# EasyEDA Pro project ProProject_P1_2024-06-12.epro, board PCB5
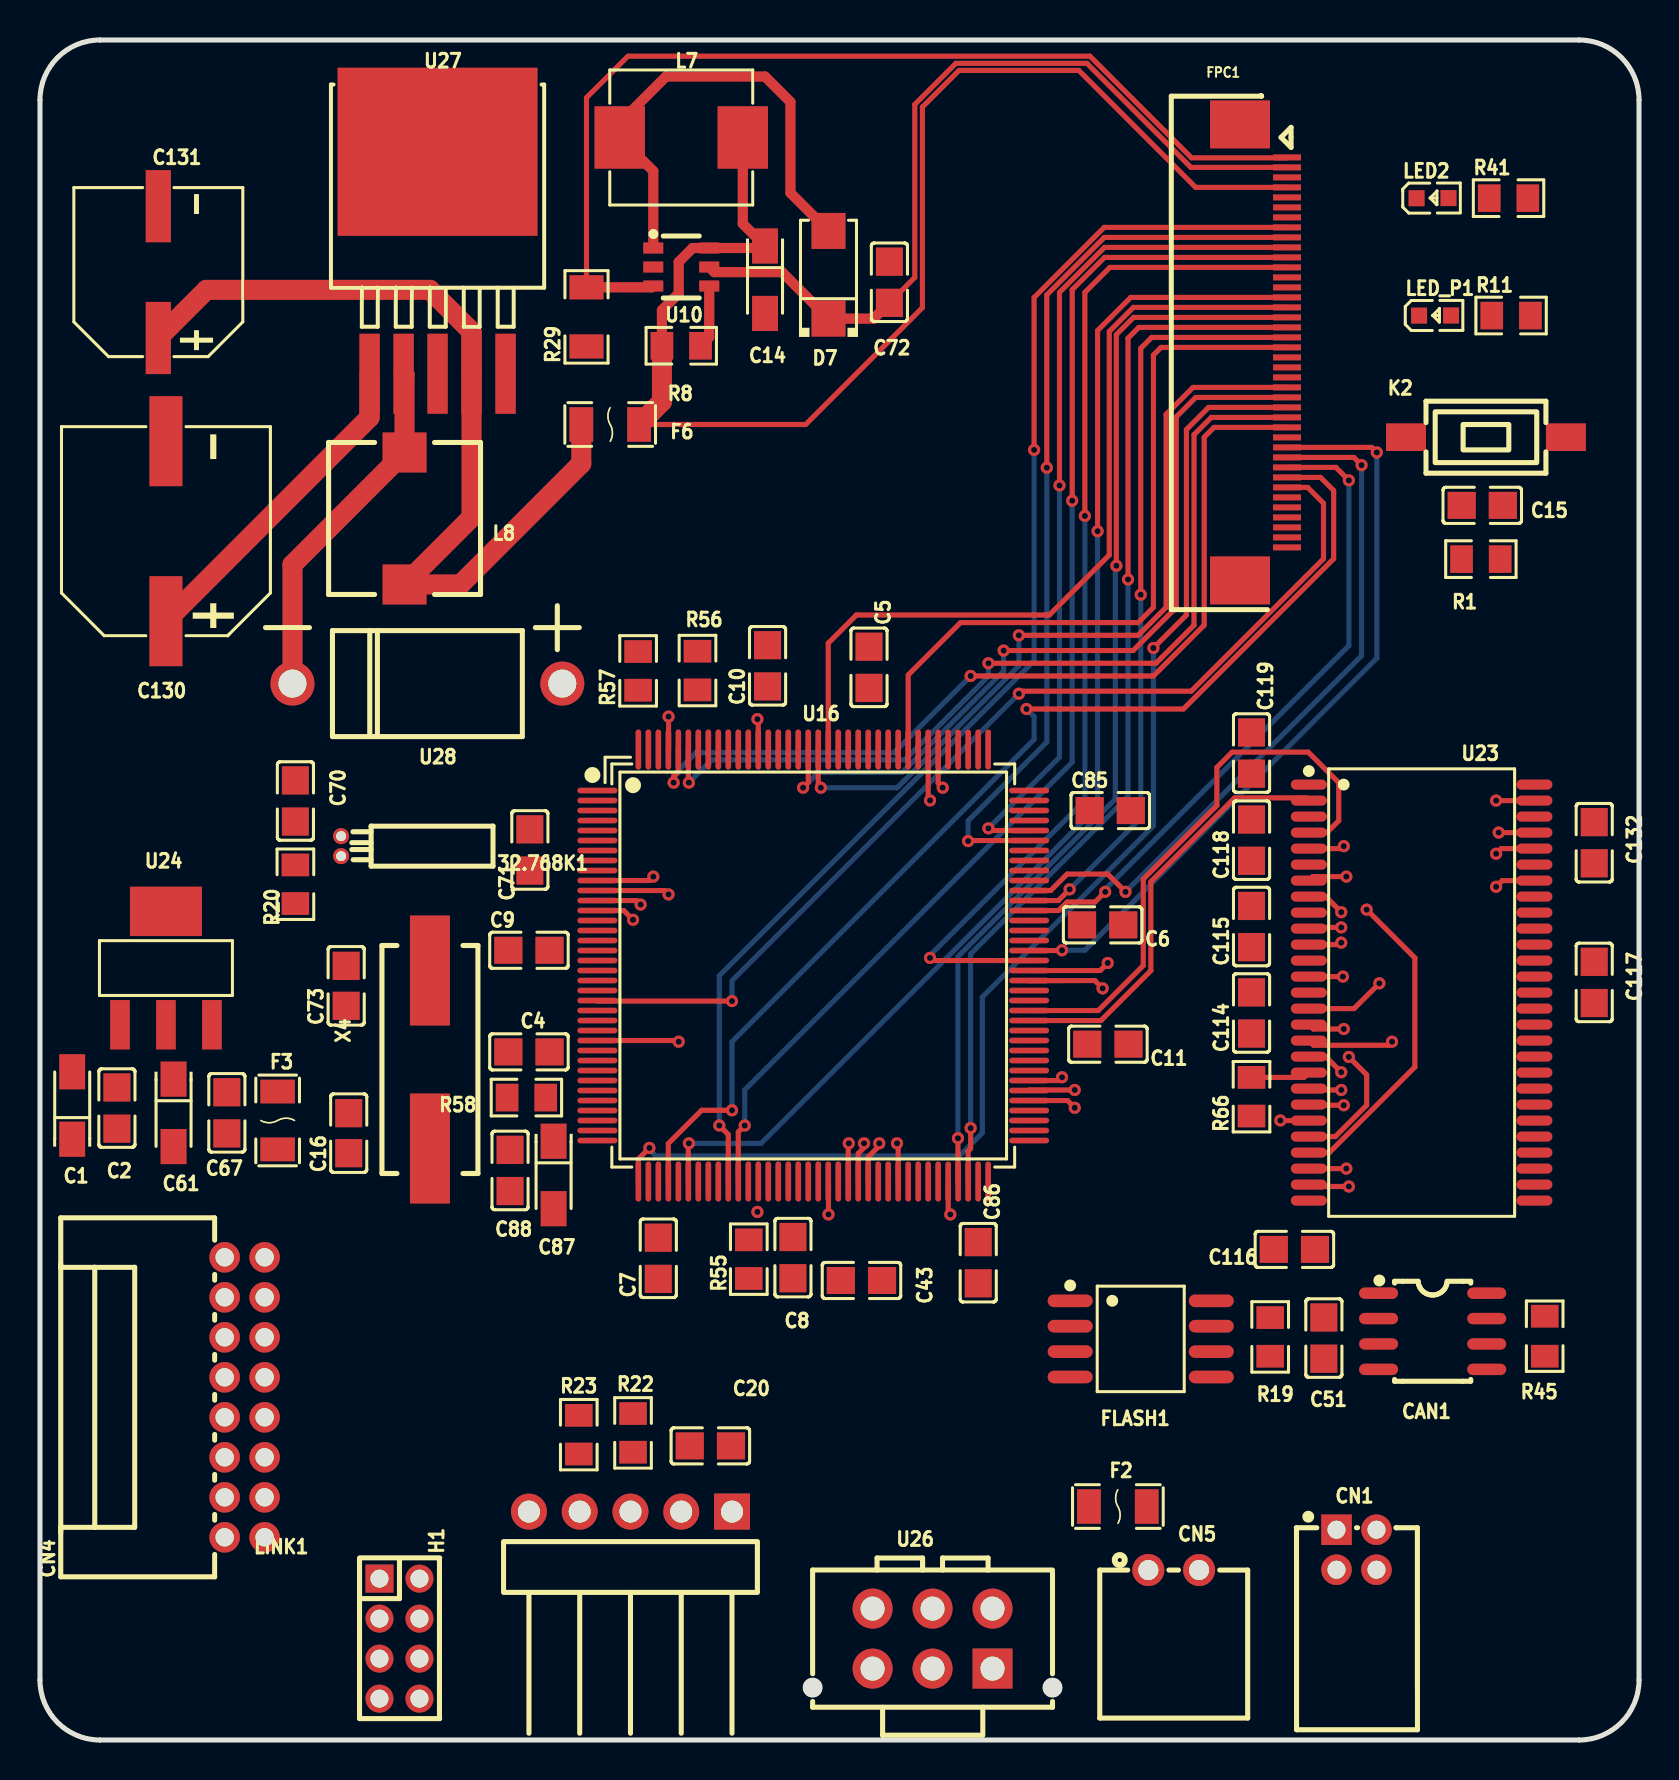
[diagram p1: board, top side]
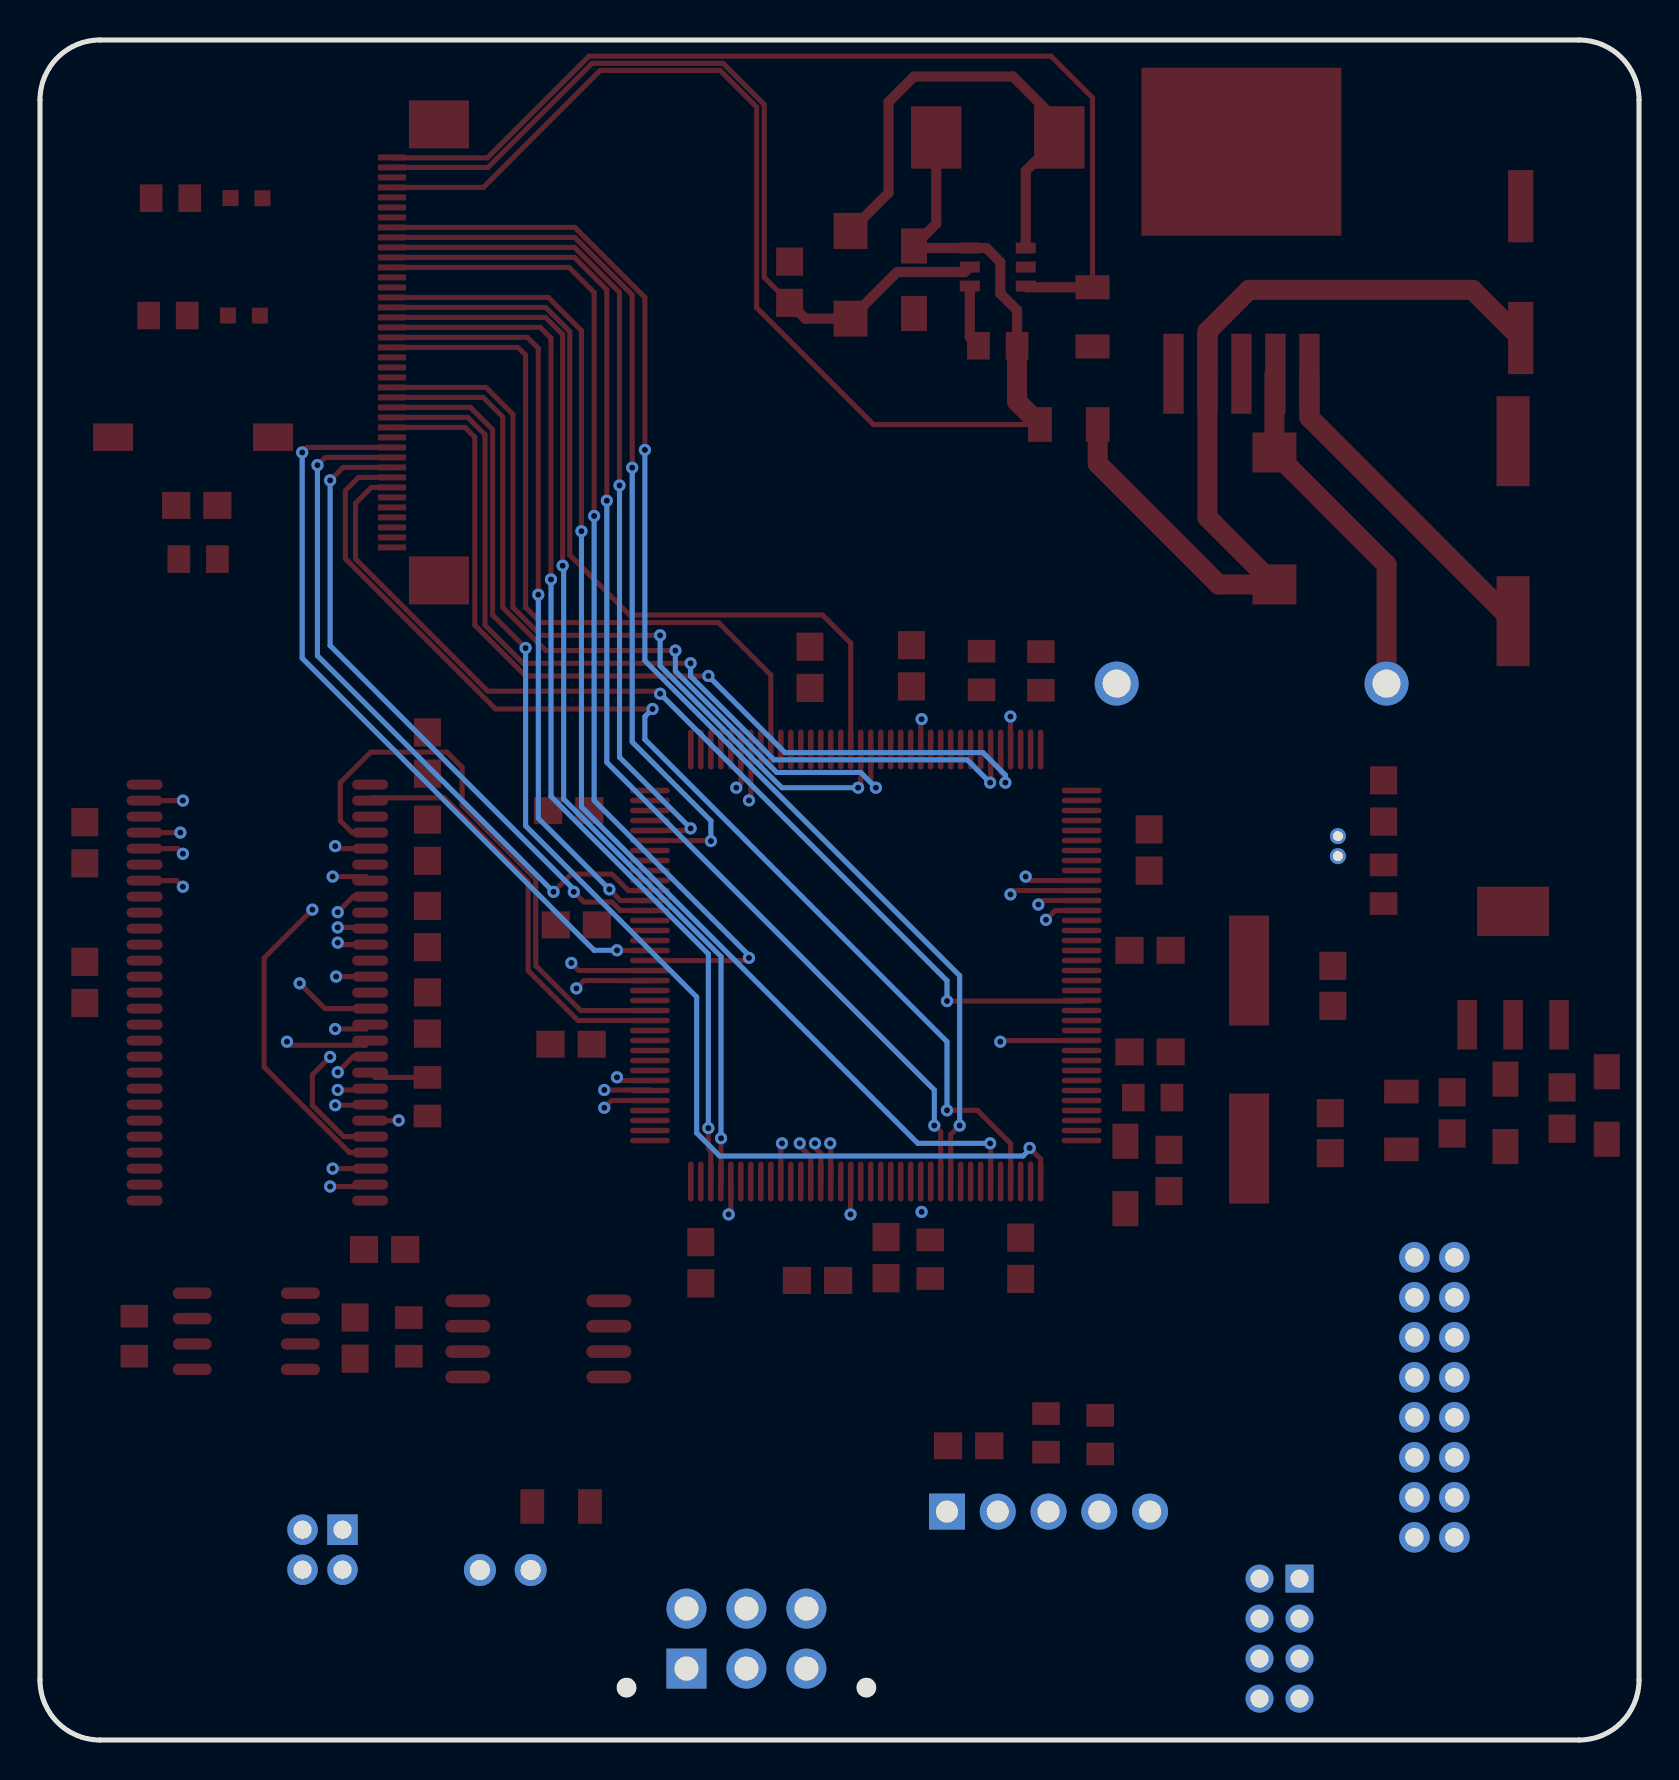
[diagram p2: board, bottom side, seen from below]

Outline 80 x 85 mm; copper layers: Top Layer, Inner1, Inner2, Bottom Layer. Coordinates in mm from the lower left corner of the outline.
Outline path: 0,82 0,3 arc(0.88,0.88) 3,0 77,0 arc(79.12,0.88) 80,3 80,82 arc(79.12,84.12) 77,85 3,85 arc(0.88,84.12) 0,82
Stack: Top Layer 0.035mm 外层铜厚1oz / Dielectric1 0.2104mm 7628 RC49% 8.6mil / Inner1 0.0152mm 内层铜厚 / Dielectric2 1.065mm 1.1mm H/HOZ 含铜 / Inner2 0.0152mm 内层铜厚 / Dielectric3 0.2104mm 7628 RC49% 8.6mil / Bottom Layer 0.035mm 外层铜厚1oz

## Design rules (mm)
template: JLCPCB Capability(Two Layers Board)
spacing copperThickness1oz (default): track to track 0.102, other pairs 0.152 to 0.3
spacing copperThickness2oz: track to track 0.203, other pairs 0.152 to 0.3
track width copperThickness1oz (default): min 0.127, default 0.254, max 2.54
track width copperThickness2oz: min 0.203, default 0.254, max 2.54
differential pair differentialPair (default): width min 0.127, default 0.254, max 2.54; gap min 0.152, default 0.152
via viaSize (default): diameter min 0.5, default 0.61, max 10; hole min 0.3, default 0.305, max 6.3

## Placement (name value [footprint] x y rotation side)
32.768K1  32.768kHz  [OSC-TH_BD2.0-P0.70-D0.3]  15.06 44.69 180 top
C1  10uF  [CAP-SMD_L3.2-W1.6-RD]  1.61 31.72 90 top
C2  100nF  [C0805]  3.85 31.6 270 top
C4  100nF  [C0805]  24.46 34.41 180 top
C5  100nF  [C0805]  41.48 53.63 270 top
C6  100nF  [C0805]  53.17 40.76 180 top
C7  100nF  [C0805]  30.94 24.09 90 top
C8  100nF  [C0805]  37.67 24.12 90 top
C9  100nF  [C0805]  24.46 39.49 0 top
C10  100nF  [C0805]  36.4 53.71 90 top
C11  100nF  [C0805]  53.43 34.79 180 top
C14  10uF  [CAP-SMD_L3.2-W1.6-RD]  36.27 73.01 270 top
C15  100nF  [C0805]  72.16 61.73 180 top
C16  22pF  [C0805#2]  15.45 30.34 90 top
C20  100nF  [C0805]  33.54 14.71 180 top
C43  100nF  [C0805]  41.1 22.98 0 top
C51  100nF  [C0805]  64.23 20.1 270 top
C61  10uF  [CAP-SMD_L3.2-W1.6-RD]  6.68 31.36 270 top
C67  100nF  [C0805]  9.35 31.36 90 top
C70  12pF  [C0805]  12.78 46.95 90 top
C71  12pF  [C0805]  24.51 44.5 90 top
C72  1uF  [C0805]  42.5 72.89 90 top
C73  22pF  [C0805#2]  15.32 37.71 90 top
C85  22uF  [C0805]  53.55 46.47 0 top
C86  22uF  [C0805]  46.94 23.86 270 top
C87  10uF  [CAP-SMD_L3.2-W1.6-RD]  25.7 28.25 270 top
C88  100nF  [C0805]  23.52 28.48 90 top
C114  100nF  [C0805]  60.61 36.35 90 top
C115  100nF  [C0805]  60.61 40.67 90 top
C116  100nF  [C0805]  62.76 24.53 180 top
C117  100nF  [C0805]  77.76 37.88 90 top
C118  100nF  [C0805]  60.61 44.99 90 top
C119  100nF  [C0805]  60.61 49.35 270 top
C130  680uF  [CAP-SMD_BD10.0-L10.3-W10.3-LS10.9-FD]  6.3 60.44 90 top
C131  220uF  [CAP-SMD_BD8.0-L8.3-W8.3-RD]  5.92 73.39 270 top
C132  100nF  [C0805]  77.76 44.86 270 top
CAN1  TJA1050T/CM,118  [SOIC-8_L5.0-W4.0-P1.27-LS6.0-BL]  69.67 20.44 270 top
CN1  M2026R-2x2P  [CONN-TH_M2026R-2X2P]  65.86 9.51 0 top
CN4  PHB-2*8AW  [CONN-TH_PHB-2-8AW]  10.24 17.13 90 top
CN5  XH-2AW  [CONN-TH_XH-2AW_C2908611]  56.72 8.5 0 top
D7  SS16  [SMA_L4.4-W2.6-LS5.0-RD]  39.45 73.26 90 top
F2  BSMD1206-200-12V  [F1206]  53.93 11.67 180 top
F3  BSMD1206-100-24V  [F1206]  11.89 30.98 270 top
F6  BSMD1206-100-24V  [F1206]  28.53 65.78 0 top
FLASH1  W25Q128JVSIQ  [SOIC-8_L5.3-W5.3-P1.27-LS8.0-BL]  55.07 20.06 270 top
FPC1  F0501-B-40-20T-R  [FPC-SMD_40P-P0.50_L4.4-W25.6]  61.21 69.38 270 top
H1  PZ200-2-04-Z  [HDR-TH_8P-P2.00-V-M-R2-C4-S2.00]  17.99 5.07 270 top
K2  RESET_KEY  [SW-SMD_L6.1-W3.6-LS8.0]  72.34 65.14 0 top
L7  22uH  [IND-SMD_L7.3-W6.6_MHCI06030]  32.08 80.13 0 top
L8  10uH  [IND-SMD_L7.6-W7.6]  18.24 61.08 90 top
LED2  NCD0603W1  [LED0603-RD]  69.67 77.09 0 top
LED_P1  NCD0603W1  [LED0603-RD]  69.8 71.22 0 top
LINK1  五线下载电路  [HDR-TH_5P-P2.54-H-M-W10.0-N]  29.54 11.42 180 top
R1  10kΩ  [R0805#2]  72.09 59.04 0 top
R8  10kΩ  [R0805#2]  32.08 69.71 0 top
R11  510  [R0805#2]  73.6 71.22 0 top
R19  22R  [R0805#2]  61.55 20.15 90 top
R20  1kΩ  [R0805#2]  12.78 42.79 270 top
R22  10kΩ  [R0805#2]  29.67 15.36 270 top
R23  10kΩ  [R0805#2]  26.96 15.27 270 top
R29  7.5Ω  [R1206]  27.34 71.16 90 top
R41  510  [R0805#2]  73.47 77.09 0 top
R45  120Ω  [R0805]  75.28 20.19 90 top
R55  10kΩ  [R0805#2]  35.46 24.04 90 top
R56  10kΩ  [R0805#2]  32.9 53.47 90 top
R57  0Ω  [R0805#2]  29.92 53.46 90 top
R58  0Ω  [R0805#2]  24.34 32.12 0 top
R66  10kΩ  [R0805#2]  60.61 32.16 90 top
U10  -  [SOT-23-6_L2.9-W1.6-P0.95-LS2.8-BR]  32.08 73.65 180 top
U16  STM32F429ZGT6  [LQFP-144_L20.0-W20.0-P0.50-LS22.0-BL]  38.69 38.72 270 top
U23  W9825G6KH-6  [TSOP-54_L22.2-W10.2-P0.80-LS11.8-BL]  69.12 37.37 270 top
U24  AMS1117-3.3  [SOT-223-4_L6.5-W3.5-P2.30-LS7.0-BR]  6.3 38.6 270 top
U26  ZX-MX3.0-2-3PZZ  [CONN-TH_6P-P3.00_HC-MX3.0-2X3A]  44.66 5.07 180 top
U27  LM2575S-3.3  [TO-263-5_L10.0-W8.4-P1.70-LS15.3-BR]  19.89 73.86 270 top
U28  1N5824  [DO-201AD_BD5.3-L9.5-P13.50-D1.4-RD]  19.38 52.82 0 top
X4  8MHz  [CRYSTAL-SMD_L11.5-W4.8-LS12.7]  19.51 34.03 270 top

## Footprints (pads in the part's own frame, mm; a bottom-side part is the same pattern mirrored in y, then rotated)
C0805
  rect 1.41x1.35 smd: 1(-1.03,0) 2(1.03,0)
C0805#2
  rect 1.41x1.35 smd: 1(-1,0) 2(1,0)
CAP-SMD_BD8.0-L8.3-W8.3-RD
  rect 3.61x1.26 smd: 1(3.295,0) 2(-3.295,0)
CAP-SMD_BD10.0-L10.3-W10.3-LS10.9-FD
  rect 4.5x1.65 smd: 1(-4.5,0) 2(4.5,0)
CAP-SMD_L3.2-W1.6-RD
  rect 1.758x1.296 smd: 1(-1.687,0) 2(1.687,0)
CONN-TH_6P-P3.00_HC-MX3.0-2X3A
  rect 2x2 hole 1.2: 1(-3,1.5)
  round 2 hole 1.2: 2(-3,-1.5) 3(0,1.5) 4(0,-1.5) 5(3,1.5) 6(3,-1.5)
CONN-TH_M2026R-2X2P
  rect 1.524x1.524 hole 0.9: 1(-1,1)
  round 1.524 hole 0.9: 2(1,1) 3(1,-1) 4(-1,-1)
CONN-TH_PHB-2-8AW
  round 1.524 hole 0.914: 1(-7,-0.999) 2(-7,1) 3(-5.001,-0.999) 4(-5.001,1) 5(-3,-1) 6(-3,1) 7(-1,-1) 8(-1,1) 9(1,-1) 10(1,1) 11(3,-1) 12(3,1) 13(5,-1) 14(5,1) 15(7,-1) 16(7,1)
CONN-TH_XH-2AW_C2908611
  round 1.6 hole 1: 1(-1.27,0) 2(1.27,0)
CRYSTAL-SMD_L11.5-W4.8-LS12.7
  rect 5.499x1.999 smd: 1(-4.45,0) 2(4.45,0)
DO-201AD_BD5.3-L9.5-P13.50-D1.4-RD
  round 2.2 hole 1.4: 1(-6.75,0) 2(6.75,0)
F1206
  rect 1.19x1.728 smd: 1(-1.445,0) 2(1.445,0)
FPC-SMD_40P-P0.50_L4.4-W25.6
  rect 2.4x3 smd: 0(-11.4,-1.175) 0(11.4,-1.175)
  rect 0.3x1.4 smd: 1(-9.75,1.175) 2(-9.25,1.175) 3(-8.75,1.175) 4(-8.25,1.175) 5(-7.75,1.175) 6(-7.25,1.175) 7(-6.75,1.175) 8(-6.25,1.175) 9(-5.75,1.175) 10(-5.25,1.175) 11(-4.75,1.175) 12(-4.25,1.175) 13(-3.75,1.175) 14(-3.25,1.175) 15(-2.75,1.175) 16(-2.25,1.175) 17(-1.75,1.175) 18(-1.25,1.175) 19(-0.75,1.175) 20(-0.25,1.175) 21(0.25,1.175) 22(0.75,1.175) 23(1.25,1.175) 24(1.75,1.175) 25(2.25,1.175) 26(2.75,1.175) 27(3.25,1.175) 28(3.75,1.175) 29(4.25,1.175) 30(4.75,1.175) 31(5.25,1.175) 32(5.75,1.175) 33(6.25,1.175) 34(6.75,1.175) 35(7.25,1.175) 36(7.75,1.175) 37(8.25,1.175) 38(8.75,1.175) 39(9.25,1.175) 40(9.75,1.175)
HDR-TH_5P-P2.54-H-M-W10.0-N
  rect 1.8x1.8 hole 1.1: 1(-5.08,0)
  round 1.8 hole 1.1: 2(-2.54,0) 3(0,0) 4(2.54,0) 5(5.08,0)
HDR-TH_8P-P2.00-V-M-R2-C4-S2.00
  rect 1.4x1.4 hole 0.9: 1(-3,-1)
  round 1.4 hole 0.9: 2(-3,1) 3(-1,-1) 4(-1,1) 5(1,-1) 6(1,1) 7(3,-1) 8(3,1)
IND-SMD_L7.3-W6.6_MHCI06030
  rect 2.524x3.12 smd: 1(-3.078,0) 2(3.078,0)
IND-SMD_L7.6-W7.6
  rect 2x2.2 smd: 1(-3.3,0) 2(3.3,0)
LED0603-RD
  rect 0.8x0.8 smd: 1(-0.799,-0.004) 2(0.799,0.004)
LQFP-144_L20.0-W20.0-P0.50-LS22.0-BL
  oval 0.28x2 smd: 1(-8.75,-10.8) 2(-8.25,-10.8) 3(-7.75,-10.8) 4(-7.25,-10.8) 5(-6.75,-10.8) 6(-6.25,-10.8) 7(-5.75,-10.8) 8(-5.25,-10.8) 9(-4.75,-10.8) 10(-4.25,-10.8) 11(-3.75,-10.8) 12(-3.25,-10.8) 13(-2.75,-10.8) 14(-2.25,-10.8) 15(-1.75,-10.8) 16(-1.25,-10.8) 17(-0.75,-10.8) 18(-0.25,-10.8) 19(0.25,-10.8) 20(0.75,-10.8) 21(1.25,-10.8) 22(1.75,-10.8) 23(2.25,-10.8) 24(2.75,-10.8) 25(3.25,-10.8) 26(3.75,-10.8) 27(4.25,-10.8) 28(4.75,-10.8) 29(5.25,-10.8) 30(5.75,-10.8) 31(6.25,-10.8) 32(6.75,-10.8) 33(7.25,-10.8) 34(7.75,-10.8) 35(8.25,-10.8) 36(8.75,-10.8) 73(8.75,10.8) 74(8.25,10.8) 75(7.75,10.8) 76(7.25,10.8) 77(6.75,10.8) 78(6.25,10.8) 79(5.75,10.8) 80(5.25,10.8) 81(4.75,10.8) 82(4.25,10.8) 83(3.75,10.8) 84(3.25,10.8) 85(2.75,10.8) 86(2.25,10.8) 87(1.75,10.8) 88(1.25,10.8) 89(0.75,10.8) 90(0.25,10.8) 91(-0.25,10.8) 92(-0.75,10.8) 93(-1.25,10.8) 94(-1.75,10.8) 95(-2.25,10.8) 96(-2.75,10.8) 97(-3.25,10.8) 98(-3.75,10.8) 99(-4.25,10.8) 100(-4.75,10.8) 101(-5.25,10.8) 102(-5.75,10.8) 103(-6.25,10.8) 104(-6.75,10.8) 105(-7.25,10.8) 106(-7.75,10.8) 107(-8.25,10.8) 108(-8.75,10.8)
  oval 2x0.28 smd: 37(10.8,-8.75) 38(10.8,-8.25) 39(10.8,-7.75) 40(10.8,-7.25) 41(10.8,-6.75) 42(10.8,-6.25) 43(10.8,-5.75) 44(10.8,-5.25) 45(10.8,-4.75) 46(10.8,-4.25) 47(10.8,-3.75) 48(10.8,-3.25) 49(10.8,-2.75) 50(10.8,-2.25) 51(10.8,-1.75) 52(10.8,-1.25) 53(10.8,-0.75) 54(10.8,-0.25) 55(10.8,0.25) 56(10.8,0.75) 57(10.8,1.25) 58(10.8,1.75) 59(10.8,2.25) 60(10.8,2.75) 61(10.8,3.25) 62(10.8,3.75) 63(10.8,4.25) 64(10.8,4.75) 65(10.8,5.25) 66(10.8,5.75) 67(10.8,6.25) 68(10.8,6.75) 69(10.8,7.25) 70(10.8,7.75) 71(10.8,8.25) 72(10.8,8.75) 109(-10.8,8.75) 110(-10.8,8.25) 111(-10.8,7.75) 112(-10.8,7.25) 113(-10.8,6.75) 114(-10.8,6.25) 115(-10.8,5.75) 116(-10.8,5.25) 117(-10.8,4.75) 118(-10.8,4.25) 119(-10.8,3.75) 120(-10.8,3.25) 121(-10.8,2.75) 122(-10.8,2.25) 123(-10.8,1.75) 124(-10.8,1.25) 125(-10.8,0.75) 126(-10.8,0.25) 127(-10.8,-0.25) 128(-10.8,-0.75) 129(-10.8,-1.25) 130(-10.8,-1.75) 131(-10.8,-2.25) 132(-10.8,-2.75) 133(-10.8,-3.25) 134(-10.8,-3.75) 135(-10.8,-4.25) 136(-10.8,-4.75) 137(-10.8,-5.25) 138(-10.8,-5.75) 139(-10.8,-6.25) 140(-10.8,-6.75) 141(-10.8,-7.25) 142(-10.8,-7.75) 143(-10.8,-8.25) 144(-10.8,-8.75)
OSC-TH_BD2.0-P0.70-D0.3
  round 0.8 hole 0.5: 1(0,0.5) 2(0,-0.5)
R0805
  rect 1.133x1.377 smd: 1(-1,0) 2(1,0)
R0805#2
  rect 1.133x1.377 smd: 1(-0.966,0) 2(0.966,0)
R1206
  rect 1.208x1.701 smd: 1(-1.479,0) 2(1.479,0)
SMA_L4.4-W2.6-LS5.0-RD
  rect 1.8x1.7 smd: 1(-2.192,0) 2(2.192,0)
SOIC-8_L5.0-W4.0-P1.27-LS6.0-BL
  oval 0.569x1.95 smd: 1(-1.905,-2.705) 2(-0.635,-2.705) 3(0.635,-2.705) 4(1.905,-2.705) 5(1.905,2.705) 6(0.635,2.705) 7(-0.635,2.705) 8(-1.905,2.705)
SOIC-8_L5.3-W5.3-P1.27-LS8.0-BL
  oval 0.63x2.25 smd: 1(-1.905,-3.53) 2(-0.635,-3.53) 3(0.635,-3.53) 4(1.905,-3.53) 5(1.905,3.53) 6(0.635,3.53) 7(-0.635,3.53) 8(-1.905,3.53)
SOT-23-6_L2.9-W1.6-P0.95-LS2.8-BR
  rect 1x0.55 smd: 1(1.4,-0.95) 2(1.4,0) 3(1.4,0.95) 4(-1.4,0.95) 5(-1.4,0) 6(-1.4,-0.95)
SOT-223-4_L6.5-W3.5-P2.30-LS7.0-BR
  rect 2.47x0.98 smd: 1(2.835,-2.3) 2(2.835,0) 3(2.835,2.3)
  rect 2.47x3.6 smd: 4(-2.835,0)
SW-SMD_L6.1-W3.6-LS8.0
  rect 1.999x1.379 smd: 1(-4,0) 2(4,0)
TO-263-5_L10.0-W8.4-P1.70-LS15.3-BR
  rect 4x1.02 smd: 1(5.55,-3.4) 2(5.55,-1.7) 3(5.55,0) 4(5.55,1.7) 5(5.55,3.4)
  rect 8.4x10 smd: 6(-5.55,0)
TSOP-54_L22.2-W10.2-P0.80-LS11.8-BL
  oval 0.5x1.8 smd: 1(-10.4,-5.642) 2(-9.6,-5.642) 3(-8.8,-5.642) 4(-8,-5.642) 5(-7.2,-5.642) 6(-6.4,-5.642) 7(-5.6,-5.642) 8(-4.8,-5.642) 9(-4,-5.642) 10(-3.2,-5.642) 11(-2.4,-5.642) 12(-1.6,-5.642) 13(-0.8,-5.642) 14(0,-5.642) 15(0.8,-5.642) 16(1.6,-5.642) 17(2.4,-5.642) 18(3.2,-5.642) 19(4,-5.642) 20(4.8,-5.642) 21(5.6,-5.642) 22(6.4,-5.642) 23(7.2,-5.642) 24(8,-5.642) 25(8.8,-5.642) 26(9.6,-5.642) 27(10.4,-5.642) 28(10.4,5.642) 29(9.6,5.642) 30(8.8,5.642) 31(8,5.642) 32(7.2,5.642) 33(6.4,5.642) 34(5.6,5.642) 35(4.8,5.642) 36(4,5.642) 37(3.2,5.642) 38(2.4,5.642) 39(1.6,5.642) 40(0.8,5.642) 41(0,5.642) 42(-0.8,5.642) 43(-1.6,5.642) 44(-2.4,5.642) 45(-3.2,5.642) 46(-4,5.642) 47(-4.8,5.642) 48(-5.6,5.642) 49(-6.4,5.642) 50(-7.2,5.642) 51(-8,5.642) 52(-8.8,5.642) 53(-9.6,5.642) 54(-10.4,5.642)

## Nets
+5V: C1.1 C2.2 C51.1 C130.1 CAN1.3 CN1.1 F2.2 U24.3 U26.5 U27.1
GND: C1.2 C2.1 C4.1 C5.1 C6.1 C7.1 C8.1 C9.1 C10.1 C11.1 C14.2 C15.1 C16.2 C20.2 C43.2 C51.2 C61.2 C67.1 C70.2 C71.2 C72.2 C73.2 C85.2 C86.2 C87.2 C88.1 C114.1 C115.1 C116.1 C117.1 C118.1 C119.1 C130.2 C131.2 C132.1 CAN1.2 CAN1.8 CN1.4 CN4.2 CN4.4 CN4.6 CN4.8 CN4.10 CN4.12 CN4.14 CN4.16 CN5.2 FLASH1.4 FPC1.0 FPC1.3 FPC1.5 FPC1.6 FPC1.7 FPC1.13 FPC1.14 FPC1.21 FPC1.22 FPC1.23 FPC1.29 FPC1.35 FPC1.36 FPC1.37 FPC1.38 FPC1.39 FPC1.40 K2.2 LINK1.2 R11.2 R29.1 R55.1 R56.2 U10.2 U16.16 U16.31 U16.38 U16.51 U16.61 U16.83 U16.94 U16.107 U16.120 U16.130 U23.6 U23.12 U23.28 U23.41 U23.46 U23.52 U23.54 U24.1 U26.6 U27.3 U27.5 U27.6 U28.2
VCC: C4.2 C5.2 C6.2 C7.2 C8.2 C9.2 C10.2 C11.2 C20.1 C43.1 C87.1 C88.2 C114.2 C115.2 C116.2 C117.2 C118.2 C119.2 C132.2 F3.2 FLASH1.3 FLASH1.7 FLASH1.8 LED2.2 LED_P1.2 LINK1.1 R1.2 R22.1 R23.1 R57.1 R58.1 R66.1 U16.17 U16.30 U16.39 U16.52 U16.62 U16.72 U16.84 U16.95 U16.108 U16.121 U16.131 U16.144 U23.1 U23.3 U23.9 U23.14 U23.27 U23.43 U23.49
VCC_LCD: C14.1 F6.2 FPC1.4 L7.2 R8.1 U10.6
VDDA: R58.2 U16.32 U16.33
CAN2_RX: CAN1.4 U16.73
CAN2_TX: CAN1.1 U16.74
CAN_H: CAN1.7 CN1.2 H1.4 R45.2
CAN_L: CAN1.6 CN1.3 H1.3 R45.1
FMC_A0: U16.10 U23.23
FMC_A1: U16.11 U23.24
FMC_A2: U16.12 U23.25
FMC_A3: U16.13 U23.26
FMC_A4: U16.14 U23.29
FMC_A5: U16.15 U23.30
FMC_A6: U16.50 U23.31
FMC_A7: U16.53 U23.32
FMC_A8: U16.54 U23.33
FMC_A9: U16.55 U23.34
FMC_A10: U16.56 U23.22
FMC_A11: U16.57 U23.35
FMC_A12: U16.87 U23.36
FMC_BA0: U16.89 U23.20
FMC_BA1: U16.90 U23.21
FMC_D0: U16.85 U23.2
FMC_D1: U16.86 U23.4
FMC_D2: U16.114 U23.5
FMC_D3: U16.115 U23.7
FMC_D4: U16.58 U23.8
FMC_D5: U16.59 U23.10
FMC_D6: U16.60 U23.11
FMC_D7: U16.63 U23.13
FMC_D8: U16.64 U23.42
FMC_D9: U16.65 U23.44
FMC_D10: U16.66 U23.45
FMC_D11: U16.67 U23.47
FMC_D12: U16.68 U23.48
FMC_D13: U16.77 U23.50
FMC_D14: U16.78 U23.51
FMC_D15: U16.79 U23.53
FMC_NBL0: U16.141 U23.15
FMC_NBL1: U16.142 U23.39
FMC_SDCAS: U16.132 U23.17
FMC_SDCKE0: U16.29 U23.37
FMC_SDCLK: U16.93 U23.38
FMC_SDNE0: R66.2 U16.28 U23.19
FMC_SDNWE: U16.26 U23.16
FMC_SDRAS: U16.49 U23.18
INPUT1: CN4.1 U16.20
INPUT2: CN4.3 U16.19
INPUT3: CN4.5 U16.18
INPUT4: CN4.7 U16.5
INPUT5: CN4.9 U16.4
INPUT6: CN4.11 U16.3
INPUT7: CN4.13 U16.2
INPUT8: CN4.15 U16.1
LED1: R41.2 U16.136
LEDA: C72.1 D7.1 FPC1.2 U10.5
LEDK: FPC1.1 R29.2 U10.3
LTDC-B5: FPC1.26 U16.37
LTDC_B3: FPC1.24 U16.126
LTDC_B4: FPC1.25 U16.127
LTDC_B6: FPC1.27 U16.139
LTDC_B7: FPC1.28 U16.140
LTDC_CLK: FPC1.30 U16.92
LTDC_DE: FPC1.34 U16.22
LTDC_DISP: FPC1.31 U16.98
LTDC_G2: FPC1.15 U16.42
LTDC_G3: FPC1.16 U16.125
LTDC_G4: FPC1.17 U16.69
LTDC_G5: FPC1.18 U16.70
LTDC_G6: FPC1.19 U16.97
LTDC_G7: FPC1.20 U16.117
LTDC_HSYNC: FPC1.32 U16.96
LTDC_R3: FPC1.8 U16.46
LTDC_R4: FPC1.9 U16.103
LTDC_R5: FPC1.10 U16.104
LTDC_R6: FPC1.11 U16.47
LTDC_R7: FPC1.12 U16.91
LTDC_VSYNC: FPC1.33 U16.40
OSC32_IN: 32.768K1.2 C70.1 U16.8
OSC32_OUT: R20.2 U16.9
PA13/TMS: LINK1.3 R22.2 U16.105
PA14/TCK: LINK1.4 R23.2 U16.109
PH0_OSC_IN: C73.1 U16.23 X4.1
PH1_OSC_OUT: C16.1 U16.24 X4.2
PWR_4G: U16.81 U26.1
RESET: C15.2 K2.1 LINK1.5 R1.1 U16.25
RST_4G: U16.80 U26.2
SPI1_CS1: FLASH1.1 U16.27
SPI1_MISO: FLASH1.2 U16.134
SPI1_MOSI: FLASH1.5 U16.43
SPI1_SCK: R19.2 U16.41
USART1_RX: H1.1 U16.102
USART1_TX: H1.2 U16.101
USART3_RX: H1.5 U16.112 U26.3
USART3_TX: H1.6 U16.111 U26.4
USART6_RX: H1.7 U16.124
USART6_TX: H1.8 U16.129
$1N34149: LED2.1 R41.1
$1N34157: LED_P1.1 R11.1
$1N34166: R8.2 U10.4
$1N34241: 32.768K1.1 C71.1 R20.1
$1N34326: FLASH1.6 R19.1
$1N34328: D7.2 L7.1 U10.1
$1N34463: R55.2 U16.48
$1N34470: R56.1 U16.138
$1N34473: C86.1 U16.71
$1N34474: R57.2 U16.143
$1N34492: C85.1 U16.106
$1N150890: CN5.1 F2.1
$1N170390: C61.1 C67.2 F3.1 U24.2
$1N192193: L8.2 U27.2 U28.1
$1N192492: C131.1 F6.1 L8.1 U27.4

Pads without a net: CAN1 5; U16 6 7 21 34 35 36 44 45 75 76 82 88 99 100 110 113 116 118 119 122 123 128 133 135 137; U23 40; U24 4

## Via types
v1: diameter 0.61, hole 0.305, Top Layer to Bottom Layer, 80 vias

## Routing (per net, layer and track width the routed paths; a pad name or vN(x,y) marks a point on that pad's centre or on a via; arc(x,y) is an arc through that point)
+5V: length 16.6
  Top Layer w1: U27.1 16.49,66.13 C130.1
VCC_LCD: length 67.5
  Top Layer w0.254: F6.2 38.31,65.78 44.15,71.62 44.15,81.65 45.98,83.48 51.97,83.48 57.82,77.63 FPC1.4
  Top Layer w0.508: R8.1 31.12,71.49 31.96,72.33 31.96,73.9 32.65,74.6 U10.6 36.17,74.6 C14.1 35.16,75.81 L7.2
  Top Layer w1: F6.2 31.12,66.92 R8.1
FMC_A0: length 56.9
  Top Layer w0.254: v1(30.69,43.17) 30.49,42.97 U16.10 ; v1(65.48,34.15) 66.37,33.26 66.37,31.74 64.8,30.17 U23.23
  Inner1 w0.254: v1(30.69,43.17) 30.69,35.17 31.7,34.15 34.5,34.15 39.96,28.69 58.44,28.69 63.9,34.15 v1(65.48,34.15)
FMC_A1: length 55
  Top Layer w0.254: v1(66.37,41.52) 68.79,39.11 68.79,33.65 64.51,29.37 U23.24 ; v1(31.45,42.28) 31.25,42.47 U16.11
  Inner1 w0.254: v1(31.45,42.28) 31.96,41.77 64.47,41.77 64.72,42.03 65.86,42.03 v1(66.37,41.52)
FMC_A2: length 57.2
  Top Layer w0.254: v1(30.05,41.77) 29.85,41.97 U16.12 ; U23.25 v1(65.36,28.57)
  Inner1 w0.254: v1(30.05,41.77) 30.33,41.49 30.33,35.02 31.55,33.8 34.35,33.8 34.75,33.39 34.75,33.39 37.54,30.6 37.54,29.45 35,26.91 35,26.28 35.59,25.69 39.69,25.69 41.55,27.55 64.33,27.55 v1(65.36,28.57)
FMC_A3: length 56.9
  Top Layer w0.254: U23.26 63.58,27.67 v1(65.48,27.67) ; U16.13 29.21,41.47 v1(29.67,41.01)
  Inner1 w0.254: v1(65.48,27.67) 64.98,27.17 41.86,27.17 39.96,25.26 35.51,25.26 34.65,26.13 34.65,27.06 37.16,29.58 37.16,30.47 34.25,33.39 34.25,33.39 34.2,33.44 31.41,33.44 29.97,34.87 29.97,40.71 v1(29.67,41.01)
FMC_A10: length 28.1
  Top Layer w0.254: U23.22 62.06,30.97 v1(62.05,30.98) ; v1(39.45,26.28) 39.45,27.91 U16.56
  Inner1 w0.254: v1(62.05,30.98) 59.01,27.93 40.34,27.93 39.45,27.04 v1(39.45,26.28)
FMC_BA0: length 22.7
  Top Layer w0.254: v1(65.1,32.5) 63.55,32.5 U23.20 ; U16.89 49.48,37.96 52.77,37.97 v1(53.17,37.58)
  Inner1 w0.254: v1(53.17,37.58) 54.53,36.22 65.39,36.22 66.12,35.49 66.12,33.52 v1(65.1,32.5)
FMC_BA1: length 26.1
  Top Layer w0.254: v1(53.42,38.85) 53.04,38.47 U16.90 ; v1(65.23,31.74) 63.51,31.74 U23.21
  Inner1 w0.254: v1(65.23,31.74) 66.63,33.14 66.63,35.8 66.37,36.06 66.37,37.84 65.23,38.98 53.55,38.98 v1(53.42,38.85)
FMC_D0: length 21.3
  Top Layer w0.254: U16.85 53.08,35.97 55.58,38.47 55.58,42.92 59.77,47.11 63.35,47.11 U23.2
FMC_D1: length 28.8
  Top Layer w0.254: U23.4 64.38,45.37 64.98,45.96 64.98,47.87 63.45,49.39 59.64,49.39 58.88,48.63 58.88,46.72 55.2,43.04 55.2,38.72 52.95,36.47 U16.86
FMC_D2: length 25.1
  Top Layer w0.254: v1(45.16,47.61) 44.94,47.84 U16.114 ; v1(65.23,44.69) 65.11,44.57 U23.5
  Inner1 w0.254: v1(65.23,44.69) 50.37,44.69 47.45,47.61 v1(45.16,47.61)
FMC_D3: length 27.8
  Top Layer w0.254: U16.115 44.44,47.07 v1(44.53,46.98) ; U23.7 63.68,43.17 v1(65.36,43.17)
  Inner1 w0.254: v1(65.36,43.17) 65.12,43.4 46.58,43.4 44.53,45.45 v1(44.53,46.98)
FMC_D4: length 33.4
  Top Layer w0.254: v1(65.1,41.39) 64.32,42.17 U23.8 ; v1(40.46,29.83) 40.44,29.81 U16.58
  Inner1 w0.254: v1(65.1,41.39) 54.12,41.39 44.97,32.25 42.62,32.25 40.46,30.09 v1(40.46,29.83)
FMC_D5: length 32.2
  Top Layer w0.254: U23.10 63.54,40.63 v1(65.1,40.63) ; v1(41.23,29.83) 41.23,29.62 40.94,29.33 U16.59
  Inner1 w0.254: v1(41.23,29.83) 41.23,30.09 43.03,31.89 45.12,31.89 53.86,40.63 v1(65.1,40.63)
FMC_D6: length 31.3
  Top Layer w0.254: U23.11 65.01,39.77 v1(65.1,39.87) ; v1(41.99,29.83) 41.99,29.71 41.44,29.16 U16.60
  Inner1 w0.254: v1(41.99,29.83) 41.99,30.22 43.26,31.48 45.22,31.48 53.6,39.87 v1(65.1,39.87)
FMC_D7: length 29.8
  Top Layer w0.254: U16.63 42.94,29.78 v1(42.88,29.83) ; U23.13 v1(65.18,38.17) 65.23,38.22
  Inner1 w0.254: v1(65.18,38.17) 52.48,38.17 45.29,30.98 43.39,30.98 42.88,30.47 v1(42.88,29.83)
FMC_D12: length 37.8
  Top Layer w0.254: v1(72.85,42.66) 73.16,42.97 74.77,42.97 ; v1(45.55,26.28) 45.44,26.39 U16.68
  Inner2 w0.254: v1(72.85,42.66) 67.39,37.2 58.37,37.2 47.45,26.28 v1(45.55,26.28)
FMC_D13: length 30.8
  Top Layer w0.254: U16.77 51.41,31.97 v1(51.77,31.61) ; 74.77,44.57 73.11,44.57 v1(72.85,44.31)
  Inner2 w0.254: v1(72.85,44.31) 72.47,44.31 67.39,39.23 59.33,39.23 51.77,31.67 v1(51.77,31.61)
FMC_D14: length 30.6
  Top Layer w0.254: v1(51.77,32.5) 49.51,32.5 U16.78 ; 74.77,45.37 v1(72.98,45.37)
  Inner2 w0.254: v1(51.77,32.5) 61.42,42.15 69.76,42.15 v1(72.98,45.37)
FMC_D15: length 31.1
  Top Layer w0.254: U16.79 50.97,32.97 v1(51.13,33.14) ; 74.77,46.97 v1(72.85,46.97)
  Inner2 w0.254: v1(51.13,33.14) 60.58,42.58 68.46,42.58 v1(72.85,46.97)
FMC_NBL0: length 51.6
  Top Layer w0.254: v1(67.01,37.84) 65.74,36.57 U23.15 ; U16.141 31.45,49.53 v1(31.45,51.17)
  Inner1 w0.254: v1(67.01,37.84) 67.29,38.11 67.29,44.29 62.56,49.01 32.59,49.01 31.45,50.15 v1(31.45,51.17)
FMC_SDCAS: length 51.1
  Top Layer w0.254: U16.132 35.94,51 v1(35.89,51.04) ; v1(67.64,34.91) 67.47,34.74 63.72,34.74 U23.17
  Inner1 w0.254: v1(67.64,34.91) 67.64,45.58 63.83,49.39 36.65,49.39 35.89,50.15 v1(35.89,51.04)
FMC_SDNE0: length 3
  Top Layer w0.254: R66.2 63.24,33.13 U23.19
FMC_SDNWE: length 44.2
  Top Layer w0.254: v1(65.23,35.55) 63.7,35.55 U23.16 ; v1(31.96,34.91) 31.9,34.97 U16.26
  Inner1 w0.254: v1(31.96,34.91) 34.37,34.91 40.03,29.25 44.07,29.25 50.37,35.55 v1(65.23,35.55)
FMC_SDRAS: length 34.4
  Top Layer w0.254: v1(65.1,33.39) 64.32,34.17 U23.18
  Inner1 w0.254: v1(65.1,33.39) 63.64,33.39 58.56,28.31 37.16,28.31 35.89,27.04 v1(35.89,26.41)
LEDA: length 42.5
  Top Layer w0.254: C72.1 43.77,73.13 43.77,81.78 45.82,83.83 52.38,83.83 57.58,78.63 FPC1.2
  Top Layer w0.508: C72.1 41.71,71.07 D7.1 37.12,73.39 33.74,73.39 U10.5
LEDK: length 50.9
  Top Layer w0.254: FPC1.1 62.37,79.11 57.61,79.11 52.53,84.19 29.42,84.19 27.34,82.12 R29.2
  Top Layer w0.508: R29.2 30.62,72.64 30.68,72.7
LTDC-B5: length 64.1
  Top Layer w0.254: U16.37 29.94,29.05 v1(30.49,29.6) ; v1(55.7,54.6) 57.36,56.25 57.36,65.52 58.46,66.63 FPC1.26
  Bottom Layer w0.254: v1(55.7,54.6) 55.7,45.71 47.15,37.15 47.15,30.35 45.99,29.2 30.81,29.2 30.43,29.58
LTDC_B3: length 40.1
  Top Layer w0.254: v1(39.07,47.61) 38.94,47.74 38.94,47.74 U16.126 ; v1(48.97,55.23) 54.94,55.23 56.34,56.63 56.34,66.28 57.69,67.63 FPC1.24
  Bottom Layer w0.254: v1(48.97,55.23) 48.97,53.7 42.88,47.61 v1(39.07,47.61)
LTDC_B4: length 40.5
  Top Layer w0.254: v1(38.18,47.61) 38.44,47.87 U16.127 ; v1(48.21,54.47) 54.69,54.47 56.85,56.63 56.85,66.16 57.82,67.13 FPC1.25
  Bottom Layer w0.254: v1(48.21,54.47) 48.21,53.45 43.14,48.38 38.94,48.38 v1(38.18,47.61)
LTDC_B6: length 45.1
  Top Layer w0.254: v1(47.45,53.84) 55.83,53.84 57.74,55.74 57.74,65.27 58.6,66.13 FPC1.27 ; U16.139 32.44,47.89 v1(32.46,47.87)
  Bottom Layer w0.254: v1(47.45,53.84) 47.45,53.19 43.27,49.01 33.61,49.01 v1(32.46,47.87)
LTDC_B7: length 45.5
  Top Layer w0.254: FPC1.28 58.73,65.63 58.24,65.14 58.24,55.74 55.7,53.2 v1(46.56,53.2) ; U16.140 31.94,48.4 31.7,48.16 v1(31.7,47.87)
  Bottom Layer w0.254: v1(46.56,53.2) 42.73,49.37 32.82,49.37 31.7,48.25 v1(31.7,47.87)
LTDC_CLK: length 38.1
  Top Layer w0.254: U16.92 50.88,39.47 ; FPC1.30 66.63,64.63 v1(66.88,64.38)
  Bottom Layer w0.254: v1(51.13,39.49) 52.28,39.49 66.88,54.09 v1(66.88,64.38)
LTDC_DE: length 51
  Top Layer w0.254: v1(34.62,36.95) 27.92,36.95 U16.22 ; FPC1.34 63.42,62.63 64.21,61.84 64.21,59.06 57.59,52.44 49.1,52.44 v1(48.97,52.31)
  Bottom Layer w0.254: v1(34.62,36.95) 34.62,37.96 v1(48.97,52.31)
LTDC_DISP: length 35.6
  Top Layer w0.254: v1(66.12,63.74) 65.73,64.13 FPC1.31 ; U16.98 50.56,42.47 51.39,43.3 53.42,43.3 v1(54.31,42.41)
  Bottom Layer w0.254: v1(54.31,42.41) 66.12,54.22 v1(66.12,63.74)
LTDC_G2: length 63.3
  Top Layer w0.254: v1(52.91,60.44) 52.91,70.47 54.57,72.13 FPC1.15 ; U16.42 32.44,29.81 v1(32.46,29.83)
  Bottom Layer w0.254: v1(32.46,29.83) 36.08,29.83 52.91,46.66 v1(52.91,60.44)
LTDC_G3: length 41.8
  Top Layer w0.254: U16.125 39.44,54.84 40.85,56.25 50.5,56.25 53.5,59.25 53.5,70.42 54.7,71.63 FPC1.16
LTDC_G4: length 54.5
  Top Layer w0.254: v1(53.85,58.71) 53.85,70.27 54.71,71.13 FPC1.17 ; U16.69 45.93,27.94 v1(45.93,30.09)
  Bottom Layer w0.254: v1(45.93,30.09) 45.93,39.17 53.8,47.05 53.8,58.66 v1(53.85,58.71)
LTDC_G5: length 53.7
  Top Layer w0.254: U16.70 46.44,29.45 46.56,29.58 v1(46.56,30.6) ; FPC1.18 54.97,70.63 54.43,70.09 v1(54.43,58.03)
  Bottom Layer w0.254: v1(54.43,58.03) 54.43,47.18 46.56,39.3 v1(46.56,30.6)
LTDC_G6: length 38.3
  Top Layer w0.254: U16.97 50.95,41.97 v1(51.51,42.53) ; v1(55.07,57.27) 55.07,69.59 55.61,70.13 FPC1.19
  Bottom Layer w0.254: v1(55.07,57.27) 55.07,46.09 v1(51.51,42.53)
LTDC_G7: length 36.9
  Top Layer w0.254: FPC1.20 56.09,69.63 55.7,69.25 55.7,56.63 54.94,55.87 46.05,55.87 43.44,53.25 U16.117
LTDC_HSYNC: length 33.2
  Top Layer w0.254: U16.96 50.96,41.47 51.39,41.9 52.78,41.9 v1(53.29,42.41) ; v1(65.48,62.98) 64.84,63.63 FPC1.32
  Bottom Layer w0.254: v1(53.29,42.41) 53.29,42.53 65.48,54.72 v1(65.48,62.98)
LTDC_R3: length 65
  Top Layer w0.254: FPC1.8 53.24,75.63 49.74,72.12 v1(49.74,64.5) ; U16.46 34.44,30.27 v1(33.99,30.72)
  Bottom Layer w0.254: v1(49.74,64.5) 49.74,53.96 33.99,38.22 v1(33.99,30.72)
LTDC_R4: length 45.2
  Top Layer w0.254: v1(46.43,44.95) 46.46,44.97 U16.103 ; FPC1.9 53.24,75.13 50.37,72.26 v1(50.37,63.62)
  Bottom Layer w0.254: v1(46.43,44.95) 46.43,45.96 50.37,49.9 v1(50.37,63.62)
LTDC_R5: length 42.7
  Top Layer w0.254: FPC1.10 53.26,74.63 51.01,72.38 v1(51.01,62.73) ; v1(47.45,45.58) 47.56,45.47 U16.104
  Bottom Layer w0.254: v1(51.01,62.73) 51.01,49.14 v1(47.45,45.58)
LTDC_R6: length 62.9
  Top Layer w0.254: v1(35.26,30.72) 34.94,30.4 U16.47 ; FPC1.11 53.26,74.13 51.64,72.51 v1(51.64,61.97)
  Bottom Layer w0.254: v1(35.26,30.72) 35.26,32.5 51.64,48.88 v1(51.64,61.97)
LTDC_R7: length 52.1
  Top Layer w0.254: v1(52.28,61.2) 52.28,72.38 53.53,73.63 FPC1.12 ; U16.91 44.66,38.97 v1(44.53,39.11)
  Bottom Layer w0.254: v1(44.53,39.11) 44.53,39.23 52.28,46.98 v1(52.28,61.2)
LTDC_VSYNC: length 56.7
  Top Layer w0.254: v1(49.36,51.55) 57.21,51.55 64.72,59.06 64.72,62.47 64.07,63.13 FPC1.33 ; v1(34.62,31.48) 33.1,31.48 31.44,29.82 U16.40
  Bottom Layer w0.254: v1(49.36,51.55) 49.74,51.17 49.74,50.03 34.62,34.91 v1(34.62,31.48)
$1N34166: length 3.2
  Top Layer w0.508: R8.2 33.48,70.15 U10.4
$1N34328: length 24.2
  Top Layer w0.508: 30.68,74.6 30.68,78.45 L7.1 29.01,80.86 31.32,83.17 36.27,83.17 37.54,81.9 37.54,77.36 D7.2
$1N192193: length 17.8
  Top Layer w1: U28.1 12.63,58.77 L8.2 18.24,68.26 U27.2
$1N192492: length 44.9
  Top Layer w1: C131.1 8.33,72.51 19.51,72.51 21.59,70.42 U27.4 21.59,61.13 L8.1 21.04,57.78 27.08,63.82 F6.1
